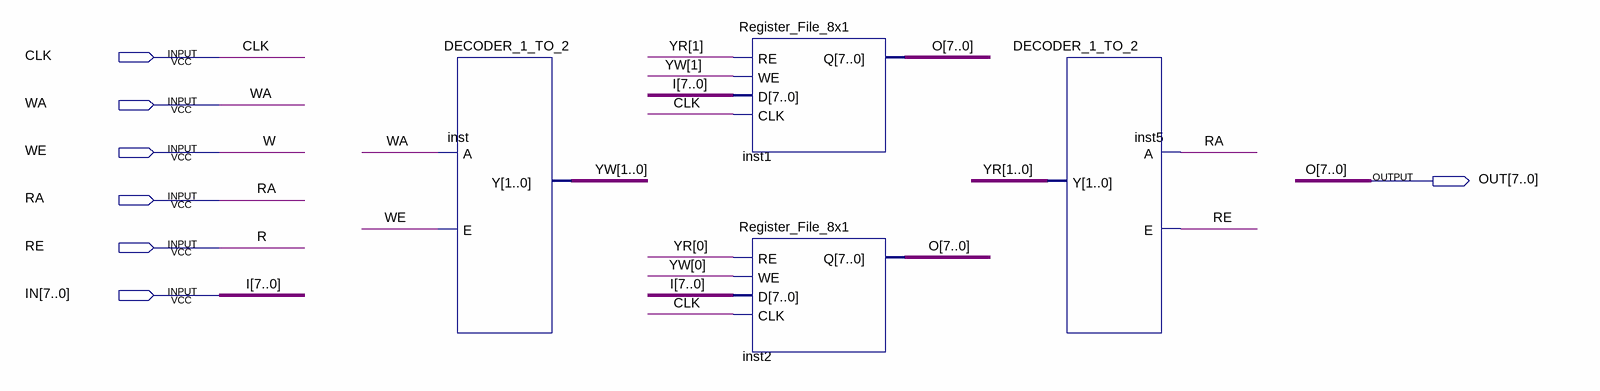
[diagram p0: schematic sheet]
// Quartus schematic Register_File_R1_R3.bdf as structural Verilog: 4 symbols, 7 pins
module Register_File_R1_R3 (
  input  CLK,
  input  WA,
  input  WE,
  input  RA,
  input  RE,
  input  [7:0] IN,
  output [7:0] OUT
);

  wire [1:0] YR, YW;

  DECODER_1_TO_2 inst (.A(WA), .E(WE), .Y(YW));
  Register_File_8x1 inst1 (.RE(YR[1]), .WE(YW[1]), .D(IN), .CLK(CLK), .Q(OUT));
  Register_File_8x1 inst2 (.RE(YR[0]), .WE(YW[0]), .D(IN), .CLK(CLK), .Q(OUT));
  DECODER_1_TO_2 inst5 (.A(RA), .E(RE), .Y(YR));

  // Other names for the same wires on the sheet: I[7:0] = IN; O[7:0] = OUT; R = RE; W = WE
endmodule
